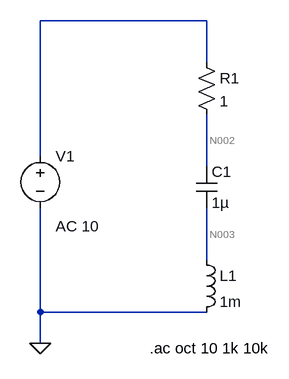
[diagram p0: schematic Draft8.asc]
Draft8.asc, the LTspice schematic file:
Version 4
SHEET 1 880 680
WIRE 336 -80 80 -80
WIRE 336 -16 336 -80
WIRE 80 128 80 -80
WIRE 336 144 336 64
WIRE 336 288 336 208
WIRE 80 368 80 208
WIRE 336 368 80 368
WIRE 80 416 80 368
FLAG 80 416 0
SYMBOL voltage 80 112 R0
WINDOW 123 24 124 Left 2
WINDOW 39 0 0 Left 0
SYMATTR InstName V1
SYMATTR Value ""
SYMATTR Value2 AC 10
SYMBOL ind 320 272 R0
SYMATTR InstName L1
SYMATTR Value 1m
SYMBOL res 320 -32 R0
SYMATTR InstName R1
SYMATTR Value 1
SYMBOL cap 320 144 R0
SYMATTR InstName C1
SYMATTR Value 1µ
TEXT 248 424 Left 2 !.ac oct 10 1k 10k

The netlist it stands for:
* Draft8.asc
V1 N001 0 AC 10
L1 N003 0 1m
R1 N001 N002 1
C1 N002 N003 1µ
.ac oct 10 1k 10k
.backanno
.end

* Results of the author's LTspice run, read from the files saved beside the schematic
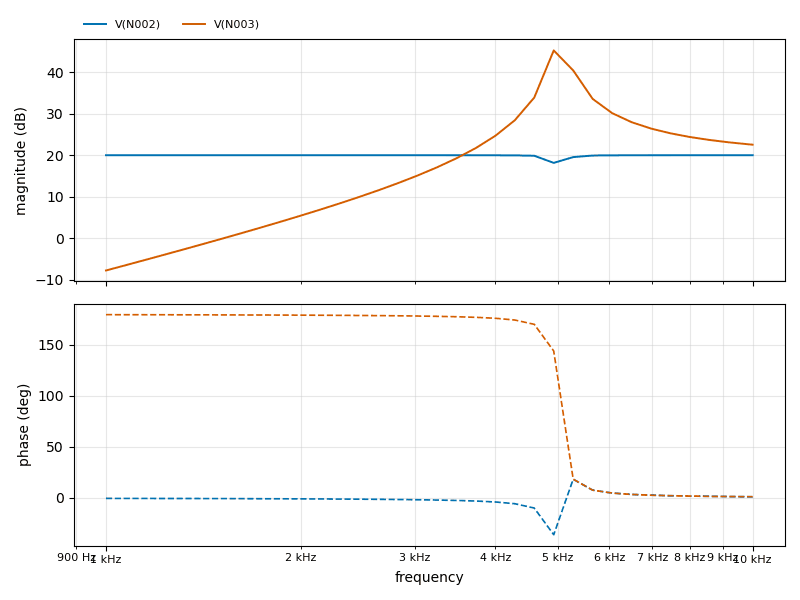
[diagram p1: AC Analysis of Draft8.asc, plotted from the saved traces]
* AC Analysis, 1 run:
*   V(N002): 20.00 dB at 1 kHz, 20.00 dB at 10 kHz, peak 20.00 dB at 1 kHz
*   V(N003): -7.72 dB at 1 kHz, 22.54 dB at 10 kHz, peak 45.19 dB at 4.925 kHz, 3 dB below the peak at 4.835 kHz and 5.143 kHz